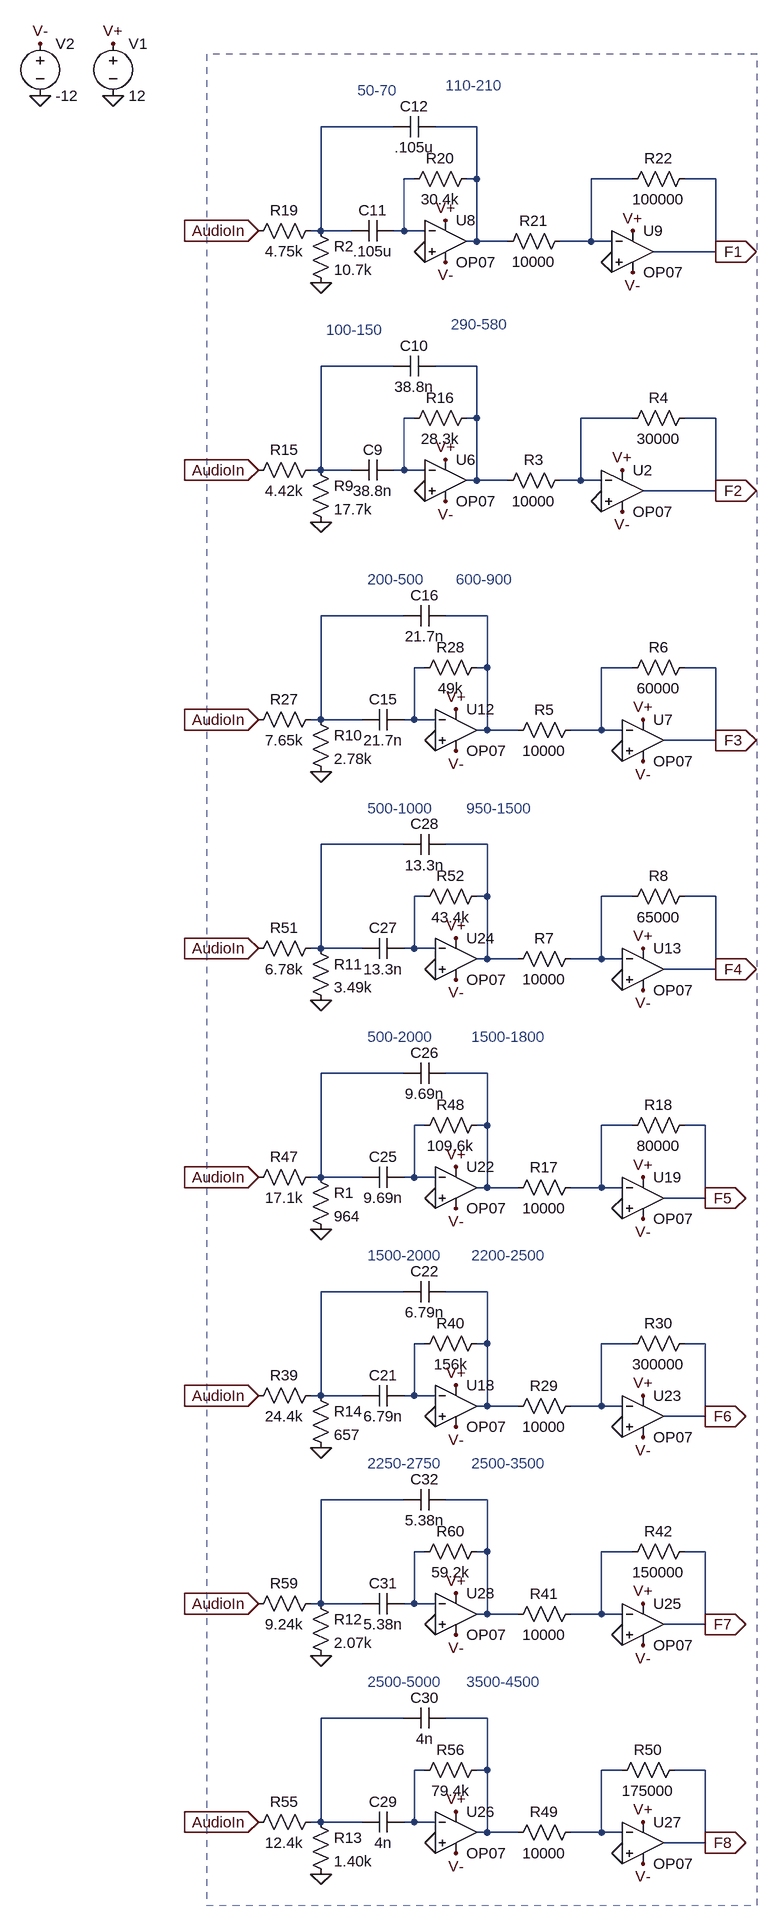
[diagram p0: schematic FilterBank.asc]
FilterBank.asc, the LTspice schematic file:
Version 4
SHEET 1 3812 1988
WIRE -656 -2016 -768 -2016
WIRE -528 -2016 -592 -2016
WIRE -624 -1936 -640 -1936
WIRE -528 -1936 -528 -2016
WIRE -528 -1936 -544 -1936
WIRE -288 -1936 -352 -1936
WIRE -160 -1936 -208 -1936
WIRE -768 -1856 -768 -2016
WIRE -768 -1856 -784 -1856
WIRE -720 -1856 -768 -1856
WIRE -640 -1856 -640 -1936
WIRE -640 -1856 -656 -1856
WIRE -608 -1856 -640 -1856
WIRE -528 -1840 -528 -1936
WIRE -528 -1840 -544 -1840
WIRE -480 -1840 -528 -1840
WIRE -352 -1840 -352 -1936
WIRE -352 -1840 -400 -1840
WIRE -320 -1840 -352 -1840
WIRE -160 -1824 -160 -1936
WIRE -160 -1824 -256 -1824
WIRE -656 -1648 -768 -1648
WIRE -528 -1648 -592 -1648
WIRE -624 -1568 -640 -1568
WIRE -528 -1568 -528 -1648
WIRE -528 -1568 -544 -1568
WIRE -288 -1568 -368 -1568
WIRE -160 -1568 -208 -1568
WIRE -768 -1488 -768 -1648
WIRE -768 -1488 -784 -1488
WIRE -720 -1488 -768 -1488
WIRE -640 -1488 -640 -1568
WIRE -640 -1488 -656 -1488
WIRE -608 -1488 -640 -1488
WIRE -528 -1472 -528 -1568
WIRE -528 -1472 -544 -1472
WIRE -480 -1472 -528 -1472
WIRE -368 -1472 -368 -1568
WIRE -368 -1472 -400 -1472
WIRE -336 -1472 -368 -1472
WIRE -160 -1456 -160 -1568
WIRE -160 -1456 -272 -1456
WIRE -640 -1264 -768 -1264
WIRE -512 -1264 -576 -1264
WIRE -608 -1184 -624 -1184
WIRE -512 -1184 -512 -1264
WIRE -512 -1184 -528 -1184
WIRE -288 -1184 -336 -1184
WIRE -160 -1184 -208 -1184
WIRE -768 -1104 -768 -1264
WIRE -768 -1104 -784 -1104
WIRE -704 -1104 -768 -1104
WIRE -624 -1104 -624 -1184
WIRE -624 -1104 -640 -1104
WIRE -592 -1104 -624 -1104
WIRE -512 -1088 -512 -1184
WIRE -512 -1088 -528 -1088
WIRE -464 -1088 -512 -1088
WIRE -336 -1088 -336 -1184
WIRE -336 -1088 -384 -1088
WIRE -304 -1088 -336 -1088
WIRE -160 -1072 -160 -1184
WIRE -160 -1072 -240 -1072
WIRE -640 -912 -768 -912
WIRE -512 -912 -576 -912
WIRE -608 -832 -624 -832
WIRE -512 -832 -512 -912
WIRE -512 -832 -528 -832
WIRE -288 -832 -336 -832
WIRE -160 -832 -208 -832
WIRE -768 -752 -768 -912
WIRE -768 -752 -784 -752
WIRE -704 -752 -768 -752
WIRE -624 -752 -624 -832
WIRE -624 -752 -640 -752
WIRE -592 -752 -624 -752
WIRE -512 -736 -512 -832
WIRE -512 -736 -528 -736
WIRE -464 -736 -512 -736
WIRE -336 -736 -336 -832
WIRE -336 -736 -384 -736
WIRE -304 -736 -336 -736
WIRE -160 -720 -160 -832
WIRE -160 -720 -240 -720
WIRE -640 -560 -768 -560
WIRE -512 -560 -576 -560
WIRE -608 -480 -624 -480
WIRE -512 -480 -512 -560
WIRE -512 -480 -528 -480
WIRE -288 -480 -336 -480
WIRE -176 -480 -208 -480
WIRE -768 -400 -768 -560
WIRE -768 -400 -784 -400
WIRE -704 -400 -768 -400
WIRE -624 -400 -624 -480
WIRE -624 -400 -640 -400
WIRE -592 -400 -624 -400
WIRE -512 -384 -512 -480
WIRE -512 -384 -528 -384
WIRE -464 -384 -512 -384
WIRE -336 -384 -336 -480
WIRE -336 -384 -384 -384
WIRE -304 -384 -336 -384
WIRE -176 -368 -176 -480
WIRE -176 -368 -240 -368
WIRE -640 -224 -768 -224
WIRE -512 -224 -576 -224
WIRE -608 -144 -624 -144
WIRE -512 -144 -512 -224
WIRE -512 -144 -528 -144
WIRE -288 -144 -336 -144
WIRE -176 -144 -208 -144
WIRE -768 -64 -768 -224
WIRE -768 -64 -784 -64
WIRE -704 -64 -768 -64
WIRE -624 -64 -624 -144
WIRE -624 -64 -640 -64
WIRE -592 -64 -624 -64
WIRE -512 -48 -512 -144
WIRE -512 -48 -528 -48
WIRE -464 -48 -512 -48
WIRE -336 -48 -336 -144
WIRE -336 -48 -384 -48
WIRE -304 -48 -336 -48
WIRE -176 -32 -176 -144
WIRE -176 -32 -240 -32
WIRE -640 96 -768 96
WIRE -512 96 -576 96
WIRE -608 176 -624 176
WIRE -512 176 -512 96
WIRE -512 176 -528 176
WIRE -288 176 -336 176
WIRE -176 176 -208 176
WIRE -768 256 -768 96
WIRE -768 256 -784 256
WIRE -704 256 -768 256
WIRE -624 256 -624 176
WIRE -624 256 -640 256
WIRE -592 256 -624 256
WIRE -512 272 -512 176
WIRE -512 272 -528 272
WIRE -464 272 -512 272
WIRE -336 272 -336 176
WIRE -336 272 -384 272
WIRE -304 272 -336 272
WIRE -176 288 -176 176
WIRE -176 288 -240 288
WIRE -640 432 -768 432
WIRE -512 432 -576 432
WIRE -608 512 -624 512
WIRE -512 512 -512 432
WIRE -512 512 -528 512
WIRE -304 512 -336 512
WIRE -176 512 -224 512
WIRE -768 592 -768 432
WIRE -768 592 -784 592
WIRE -704 592 -768 592
WIRE -624 592 -624 512
WIRE -624 592 -640 592
WIRE -592 592 -624 592
WIRE -512 608 -512 512
WIRE -512 608 -528 608
WIRE -464 608 -512 608
WIRE -336 608 -336 512
WIRE -336 608 -384 608
WIRE -304 608 -336 608
WIRE -176 624 -176 512
WIRE -176 624 -240 624
FLAG -576 -1504 V+
FLAG -576 -1440 V-
FLAG -608 -1456 0
FLAG -576 -1872 V+
FLAG -576 -1808 V-
FLAG -608 -1824 0
FLAG -288 -1856 V+
FLAG -288 -1792 V-
FLAG -560 -1120 V+
FLAG -560 -1056 V-
FLAG -592 -1072 0
FLAG -560 -80 V+
FLAG -560 -16 V-
FLAG -592 -32 0
FLAG -560 -416 V+
FLAG -560 -352 V-
FLAG -592 -368 0
FLAG -560 -768 V+
FLAG -560 -704 V-
FLAG -592 -720 0
FLAG -560 576 V+
FLAG -560 640 V-
FLAG -592 624 0
FLAG -560 240 V+
FLAG -560 304 V-
FLAG -592 288 0
FLAG -160 -1824 F1
IOPIN -160 -1824 Out
FLAG -176 -368 F5
IOPIN -176 -368 Out
FLAG -176 -32 F6
IOPIN -176 -32 Out
FLAG -160 -1456 F2
IOPIN -160 -1456 Out
FLAG -160 -1072 F3
IOPIN -160 -1072 Out
FLAG -176 624 F8
IOPIN -176 624 Out
FLAG -160 -720 F4
IOPIN -160 -720 Out
FLAG -864 -1856 AudioIn
IOPIN -864 -1856 In
FLAG -864 -752 AudioIn
IOPIN -864 -752 In
FLAG -864 -1488 AudioIn
IOPIN -864 -1488 In
FLAG -864 -400 AudioIn
IOPIN -864 -400 In
FLAG -864 -1104 AudioIn
IOPIN -864 -1104 In
FLAG -864 256 AudioIn
IOPIN -864 256 In
FLAG -864 -64 AudioIn
IOPIN -864 -64 In
FLAG -864 592 AudioIn
IOPIN -864 592 In
FLAG -176 288 F7
IOPIN -176 288 Out
FLAG -320 -1808 0
FLAG -304 -1488 V+
FLAG -304 -1424 V-
FLAG -336 -1440 0
FLAG -272 -1104 V+
FLAG -272 -1040 V-
FLAG -304 -1056 0
FLAG -272 -752 V+
FLAG -272 -688 V-
FLAG -304 -704 0
FLAG -272 -400 V+
FLAG -272 -336 V-
FLAG -304 -352 0
FLAG -272 -64 V+
FLAG -272 0 V-
FLAG -304 -16 0
FLAG -272 256 V+
FLAG -272 320 V-
FLAG -304 304 0
FLAG -272 592 V+
FLAG -272 656 V-
FLAG -304 640 0
FLAG -1200 -2064 0
FLAG -1088 -2064 0
FLAG -1088 -2144 V+
FLAG -1200 -2144 V-
FLAG -768 -320 0
FLAG -768 -1776 0
FLAG -768 672 0
FLAG -768 -1408 0
FLAG -768 -1024 0
FLAG -768 -672 0
FLAG -768 16 0
FLAG -768 336 0
SYMBOL Opamps\\OP07 -576 -1536 R0
SYMATTR InstName U6
SYMBOL res -768 -1504 R90
WINDOW 0 0 56 VBottom 2
WINDOW 3 32 56 VTop 2
SYMATTR InstName R15
SYMATTR Value 4.42k
SYMBOL cap -656 -1504 R90
WINDOW 0 0 32 VBottom 2
WINDOW 3 32 32 VTop 2
SYMATTR InstName C9
SYMATTR Value 38.8n
SYMBOL cap -592 -1664 R90
WINDOW 0 0 32 VBottom 2
WINDOW 3 32 32 VTop 2
SYMATTR InstName C10
SYMATTR Value 38.8n
SYMBOL res -528 -1584 R90
WINDOW 0 0 56 VBottom 2
WINDOW 3 32 56 VTop 2
SYMATTR InstName R16
SYMATTR Value 28.3k
SYMBOL Opamps\\OP07 -576 -1904 R0
SYMATTR InstName U8
SYMBOL res -768 -1872 R90
WINDOW 0 0 56 VBottom 2
WINDOW 3 32 56 VTop 2
SYMATTR InstName R19
SYMATTR Value 4.75k
SYMBOL cap -656 -1872 R90
WINDOW 0 0 32 VBottom 2
WINDOW 3 32 32 VTop 2
SYMATTR InstName C11
SYMATTR Value .105u
SYMBOL cap -592 -2032 R90
WINDOW 0 0 32 VBottom 2
WINDOW 3 32 32 VTop 2
SYMATTR InstName C12
SYMATTR Value .105u
SYMBOL res -528 -1952 R90
WINDOW 0 0 56 VBottom 2
WINDOW 3 32 56 VTop 2
SYMATTR InstName R20
SYMATTR Value 30.4k
SYMBOL Opamps\\OP07 -288 -1888 R0
SYMATTR InstName U9
SYMBOL res -384 -1856 R90
WINDOW 0 0 56 VBottom 2
WINDOW 3 32 56 VTop 2
SYMATTR InstName R21
SYMATTR Value 10000
SYMBOL res -192 -1952 R90
WINDOW 0 0 56 VBottom 2
WINDOW 3 32 56 VTop 2
SYMATTR InstName R22
SYMATTR Value 100000
SYMBOL Opamps\\OP07 -560 -1152 R0
SYMATTR InstName U12
SYMBOL res -768 -1120 R90
WINDOW 0 0 56 VBottom 2
WINDOW 3 32 56 VTop 2
SYMATTR InstName R27
SYMATTR Value 7.65k
SYMBOL cap -640 -1120 R90
WINDOW 0 0 32 VBottom 2
WINDOW 3 32 32 VTop 2
SYMATTR InstName C15
SYMATTR Value 21.7n
SYMBOL cap -576 -1280 R90
WINDOW 0 0 32 VBottom 2
WINDOW 3 32 32 VTop 2
SYMATTR InstName C16
SYMATTR Value 21.7n
SYMBOL res -512 -1200 R90
WINDOW 0 0 56 VBottom 2
WINDOW 3 32 56 VTop 2
SYMATTR InstName R28
SYMATTR Value 49k
SYMBOL Opamps\\OP07 -560 -112 R0
SYMATTR InstName U18
SYMBOL res -768 -80 R90
WINDOW 0 0 56 VBottom 2
WINDOW 3 32 56 VTop 2
SYMATTR InstName R39
SYMATTR Value 24.4k
SYMBOL cap -640 -80 R90
WINDOW 0 0 32 VBottom 2
WINDOW 3 32 32 VTop 2
SYMATTR InstName C21
SYMATTR Value 6.79n
SYMBOL cap -576 -240 R90
WINDOW 0 0 32 VBottom 2
WINDOW 3 32 32 VTop 2
SYMATTR InstName C22
SYMATTR Value 6.79n
SYMBOL res -512 -160 R90
WINDOW 0 0 56 VBottom 2
WINDOW 3 32 56 VTop 2
SYMATTR InstName R40
SYMATTR Value 156k
SYMBOL Opamps\\OP07 -560 -448 R0
SYMATTR InstName U22
SYMBOL res -768 -416 R90
WINDOW 0 0 56 VBottom 2
WINDOW 3 32 56 VTop 2
SYMATTR InstName R47
SYMATTR Value 17.1k
SYMBOL cap -640 -416 R90
WINDOW 0 0 32 VBottom 2
WINDOW 3 32 32 VTop 2
SYMATTR InstName C25
SYMATTR Value 9.69n
SYMBOL cap -576 -576 R90
WINDOW 0 0 32 VBottom 2
WINDOW 3 32 32 VTop 2
SYMATTR InstName C26
SYMATTR Value 9.69n
SYMBOL res -512 -496 R90
WINDOW 0 0 56 VBottom 2
WINDOW 3 32 56 VTop 2
SYMATTR InstName R48
SYMATTR Value 109.6k
SYMBOL Opamps\\OP07 -560 -800 R0
SYMATTR InstName U24
SYMBOL res -768 -768 R90
WINDOW 0 0 56 VBottom 2
WINDOW 3 32 56 VTop 2
SYMATTR InstName R51
SYMATTR Value 6.78k
SYMBOL cap -640 -768 R90
WINDOW 0 0 32 VBottom 2
WINDOW 3 32 32 VTop 2
SYMATTR InstName C27
SYMATTR Value 13.3n
SYMBOL cap -576 -928 R90
WINDOW 0 0 32 VBottom 2
WINDOW 3 32 32 VTop 2
SYMATTR InstName C28
SYMATTR Value 13.3n
SYMBOL res -512 -848 R90
WINDOW 0 0 56 VBottom 2
WINDOW 3 32 56 VTop 2
SYMATTR InstName R52
SYMATTR Value 43.4k
SYMBOL Opamps\\OP07 -560 544 R0
SYMATTR InstName U26
SYMBOL res -768 576 R90
WINDOW 0 0 56 VBottom 2
WINDOW 3 32 56 VTop 2
SYMATTR InstName R55
SYMATTR Value 12.4k
SYMBOL cap -640 576 R90
WINDOW 0 0 32 VBottom 2
WINDOW 3 32 32 VTop 2
SYMATTR InstName C29
SYMATTR Value 4n
SYMBOL cap -576 416 R90
WINDOW 0 0 32 VBottom 2
WINDOW 3 32 32 VTop 2
SYMATTR InstName C30
SYMATTR Value 4n
SYMBOL res -512 496 R90
WINDOW 0 0 56 VBottom 2
WINDOW 3 32 56 VTop 2
SYMATTR InstName R56
SYMATTR Value 79.4k
SYMBOL Opamps\\OP07 -560 208 R0
SYMATTR InstName U28
SYMBOL res -768 240 R90
WINDOW 0 0 56 VBottom 2
WINDOW 3 32 56 VTop 2
SYMATTR InstName R59
SYMATTR Value 9.24k
SYMBOL cap -640 240 R90
WINDOW 0 0 32 VBottom 2
WINDOW 3 32 32 VTop 2
SYMATTR InstName C31
SYMATTR Value 5.38n
SYMBOL cap -576 80 R90
WINDOW 0 0 32 VBottom 2
WINDOW 3 32 32 VTop 2
SYMATTR InstName C32
SYMATTR Value 5.38n
SYMBOL res -512 160 R90
WINDOW 0 0 56 VBottom 2
WINDOW 3 32 56 VTop 2
SYMATTR InstName R60
SYMATTR Value 59.2k
SYMBOL Opamps\\OP07 -304 -1520 R0
SYMATTR InstName U2
SYMBOL res -384 -1488 R90
WINDOW 0 0 56 VBottom 2
WINDOW 3 32 56 VTop 2
SYMATTR InstName R3
SYMATTR Value 10000
SYMBOL res -192 -1584 R90
WINDOW 0 0 56 VBottom 2
WINDOW 3 32 56 VTop 2
SYMATTR InstName R4
SYMATTR Value 30000
SYMBOL Opamps\\OP07 -272 -1136 R0
SYMATTR InstName U7
SYMBOL res -368 -1104 R90
WINDOW 0 0 56 VBottom 2
WINDOW 3 32 56 VTop 2
SYMATTR InstName R5
SYMATTR Value 10000
SYMBOL res -192 -1200 R90
WINDOW 0 0 56 VBottom 2
WINDOW 3 32 56 VTop 2
SYMATTR InstName R6
SYMATTR Value 60000
SYMBOL Opamps\\OP07 -272 -784 R0
SYMATTR InstName U13
SYMBOL res -368 -752 R90
WINDOW 0 0 56 VBottom 2
WINDOW 3 32 56 VTop 2
SYMATTR InstName R7
SYMATTR Value 10000
SYMBOL res -192 -848 R90
WINDOW 0 0 56 VBottom 2
WINDOW 3 32 56 VTop 2
SYMATTR InstName R8
SYMATTR Value 65000
SYMBOL Opamps\\OP07 -272 -432 R0
SYMATTR InstName U19
SYMBOL res -368 -400 R90
WINDOW 0 0 56 VBottom 2
WINDOW 3 32 56 VTop 2
SYMATTR InstName R17
SYMATTR Value 10000
SYMBOL res -192 -496 R90
WINDOW 0 0 56 VBottom 2
WINDOW 3 32 56 VTop 2
SYMATTR InstName R18
SYMATTR Value 80000
SYMBOL Opamps\\OP07 -272 -96 R0
SYMATTR InstName U23
SYMBOL res -368 -64 R90
WINDOW 0 0 56 VBottom 2
WINDOW 3 32 56 VTop 2
SYMATTR InstName R29
SYMATTR Value 10000
SYMBOL res -192 -160 R90
WINDOW 0 0 56 VBottom 2
WINDOW 3 32 56 VTop 2
SYMATTR InstName R30
SYMATTR Value 300000
SYMBOL Opamps\\OP07 -272 224 R0
SYMATTR InstName U25
SYMBOL res -368 256 R90
WINDOW 0 0 56 VBottom 2
WINDOW 3 32 56 VTop 2
SYMATTR InstName R41
SYMATTR Value 10000
SYMBOL res -192 160 R90
WINDOW 0 0 56 VBottom 2
WINDOW 3 32 56 VTop 2
SYMATTR InstName R42
SYMATTR Value 150000
SYMBOL Opamps\\OP07 -272 560 R0
SYMATTR InstName U27
SYMBOL res -368 592 R90
WINDOW 0 0 56 VBottom 2
WINDOW 3 32 56 VTop 2
SYMATTR InstName R49
SYMATTR Value 10000
SYMBOL res -208 496 R90
WINDOW 0 0 56 VBottom 2
WINDOW 3 32 56 VTop 2
SYMATTR InstName R50
SYMATTR Value 175000
SYMBOL voltage -1088 -2160 R0
WINDOW 123 0 0 Left 2
WINDOW 39 0 0 Left 2
SYMATTR InstName V1
SYMATTR Value 12
SYMBOL voltage -1200 -2160 R0
WINDOW 123 0 0 Left 2
WINDOW 39 0 0 Left 2
SYMATTR InstName V2
SYMATTR Value -12
SYMBOL res -784 -416 R0
SYMATTR InstName R1
SYMATTR Value 964
SYMBOL res -784 -1872 R0
SYMATTR InstName R2
SYMATTR Value 10.7k
SYMBOL res -784 -1504 R0
SYMATTR InstName R9
SYMATTR Value 17.7k
SYMBOL res -784 -1120 R0
SYMATTR InstName R10
SYMATTR Value 2.78k
SYMBOL res -784 -768 R0
SYMATTR InstName R11
SYMATTR Value 3.49k
SYMBOL res -784 240 R0
SYMATTR InstName R12
SYMATTR Value 2.07k
SYMBOL res -784 576 R0
SYMATTR InstName R13
SYMATTR Value 1.40k
SYMBOL res -784 -80 R0
SYMATTR InstName R14
SYMATTR Value 657
TEXT -760 -1704 Left 2 ;100-150
TEXT -712 -2072 Left 2 ;50-70
TEXT -696 -1320 Left 2 ;200-500
TEXT -696 -280 Left 2 ;1500-2000
TEXT -696 -616 Left 2 ;500-2000
TEXT -696 -968 Left 2 ;500-1000
TEXT -696 376 Left 2 ;2500-5000
TEXT -696 40 Left 2 ;2250-2750
TEXT -576 -2080 Left 2 ;110-210
TEXT -568 -1712 Left 2 ;290-580
TEXT -560 -1320 Left 2 ;600-900
TEXT -544 -968 Left 2 ;950-1500
TEXT -536 -616 Left 2 ;1500-1800
TEXT -536 -280 Left 2 ;2200-2500
TEXT -536 40 Left 2 ;2500-3500
TEXT -544 376 Left 2 ;3500-4500
RECTANGLE Normal -96 -2128 -944 720 1

The netlist it stands for:
* FilterBank.asc
XU6 0 N007 V+ V- N006 LT1001  ; OP07, pins In+ In- V+ V- OUT
R15 N005 AudioIn 4.42k
C9 N007 N005 38.8n
C10 N006 N005 38.8n
R16 N006 N007 28.3k
XU8 0 N003 V+ V- N002 LT1001  ; OP07, pins In+ In- V+ V- OUT
R19 N001 AudioIn 4.75k
C11 N003 N001 .105u
C12 N002 N001 .105u
R20 N002 N003 30.4k
XU9 0 N004 V+ V- F1 LT1001  ; OP07, pins In+ In- V+ V- OUT
R21 N004 N002 10000
R22 F1 N004 100000
XU12 0 N011 V+ V- N010 LT1001  ; OP07, pins In+ In- V+ V- OUT
R27 N009 AudioIn 7.65k
C15 N011 N009 21.7n
C16 N010 N009 21.7n
R28 N010 N011 49k
XU18 0 N023 V+ V- N022 LT1001  ; OP07, pins In+ In- V+ V- OUT
R39 N021 AudioIn 24.4k
C21 N023 N021 6.79n
C22 N022 N021 6.79n
R40 N022 N023 156k
XU22 0 N019 V+ V- N018 LT1001  ; OP07, pins In+ In- V+ V- OUT
R47 N017 AudioIn 17.1k
C25 N019 N017 9.69n
C26 N018 N017 9.69n
R48 N018 N019 109.6k
XU24 0 N015 V+ V- N014 LT1001  ; OP07, pins In+ In- V+ V- OUT
R51 N013 AudioIn 6.78k
C27 N015 N013 13.3n
C28 N014 N013 13.3n
R52 N014 N015 43.4k
XU26 0 N031 V+ V- N030 LT1001  ; OP07, pins In+ In- V+ V- OUT
R55 N029 AudioIn 12.4k
C29 N031 N029 4n
C30 N030 N029 4n
R56 N030 N031 79.4k
XU28 0 N027 V+ V- N026 LT1001  ; OP07, pins In+ In- V+ V- OUT
R59 N025 AudioIn 9.24k
C31 N027 N025 5.38n
C32 N026 N025 5.38n
R60 N026 N027 59.2k
XU2 0 N008 V+ V- F2 LT1001  ; OP07, pins In+ In- V+ V- OUT
R3 N008 N006 10000
R4 F2 N008 30000
XU7 0 N012 V+ V- F3 LT1001  ; OP07, pins In+ In- V+ V- OUT
R5 N012 N010 10000
R6 F3 N012 60000
XU13 0 N016 V+ V- F4 LT1001  ; OP07, pins In+ In- V+ V- OUT
R7 N016 N014 10000
R8 F4 N016 65000
XU19 0 N020 V+ V- F5 LT1001  ; OP07, pins In+ In- V+ V- OUT
R17 N020 N018 10000
R18 F5 N020 80000
XU23 0 N024 V+ V- F6 LT1001  ; OP07, pins In+ In- V+ V- OUT
R29 N024 N022 10000
R30 F6 N024 300000
XU25 0 N028 V+ V- F7 LT1001  ; OP07, pins In+ In- V+ V- OUT
R41 N028 N026 10000
R42 F7 N028 150000
XU27 0 N032 V+ V- F8 LT1001  ; OP07, pins In+ In- V+ V- OUT
R49 N032 N030 10000
R50 F8 N032 175000
V1 V+ 0 12
V2 V- 0 -12
R1 N017 0 964
R2 N001 0 10.7k
R9 N005 0 17.7k
R10 N009 0 2.78k
R11 N013 0 3.49k
R12 N025 0 2.07k
R13 N029 0 1.40k
R14 N021 0 657
* 100-150
* 50-70
* 200-500
* 1500-2000
* 500-2000
* 500-1000
* 2500-5000
* 2250-2750
* 110-210
* 290-580
* 600-900
* 950-1500
* 1500-1800
* 2200-2500
* 2500-3500
* 3500-4500
.lib LTC.lib
.backanno
.end